# Altium schematic sheet DAC.SchDoc
size 406 x 304 mm; SheetNumber: 3; SheetTotal: 3
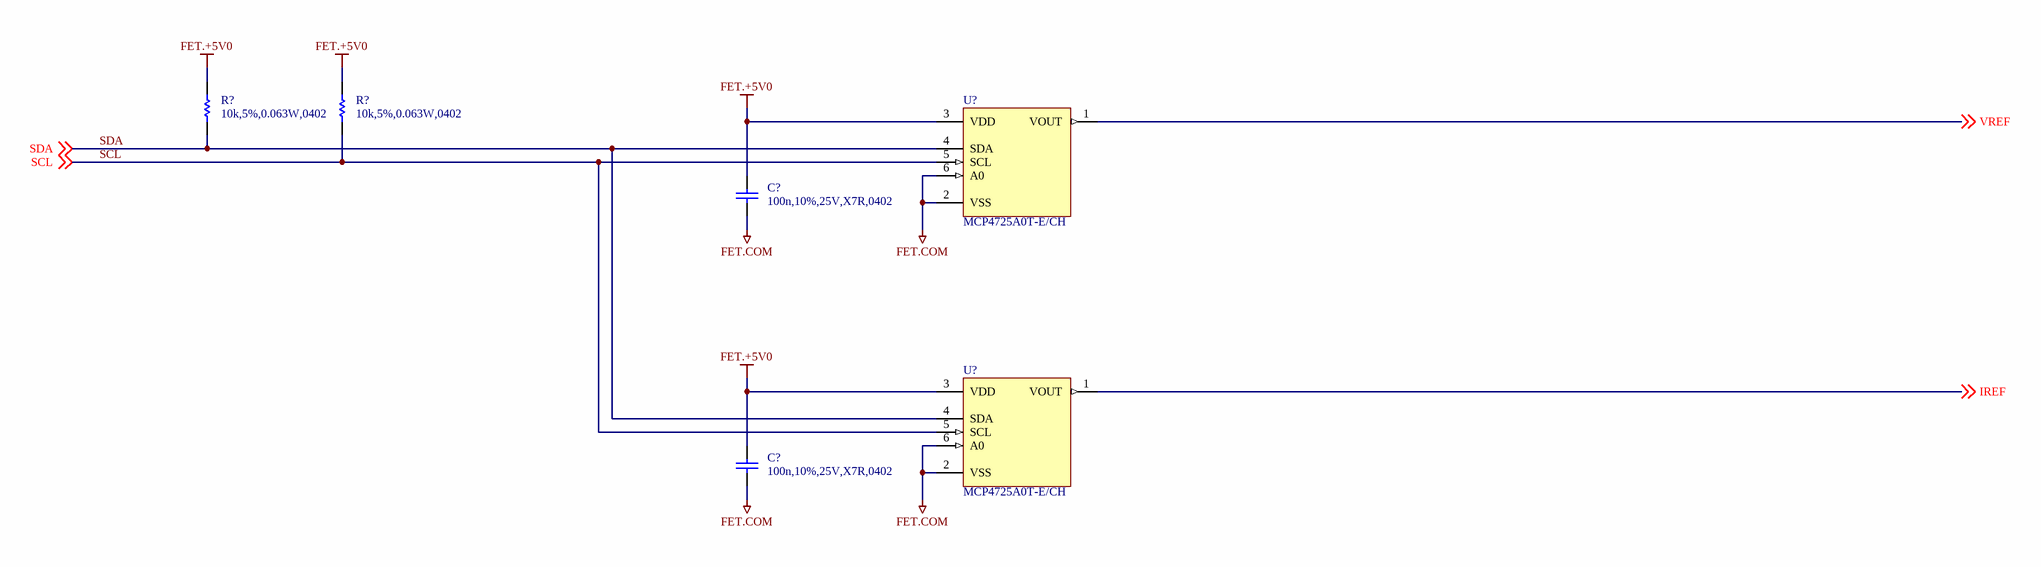
[diagram p0: DAC.SchDoc]

## Parts
(Parts that share a designator on the sheet are numbered #1, #2 ... from top to bottom, then left to right.)
C?#1  100n,10%,25V,X7R,0402  [CAPC1005X06N]
C?#2  100n,10%,25V,X7R,0402  [CAPC1005X06N]
R?#1  10k,5%,0.063W,0402  [RESC1005X04N]
R?#2  10k,5%,0.063W,0402  [RESC1005X04N]
U?#1  MCP4725A0T-E/CH  [SOTFL95P260X145-6]
U?#2  MCP4725A0T-E/CH  [SOTFL95P260X145-6]

## Nets
FET.+5V0: C?#1.2 C?#2.2 R?#1.2 R?#2.2 U?#1.3(VDD) U?#2.3(VDD)
FET.COM: C?#1.1 C?#2.1 U?#1.2(VSS) U?#1.6(A0) U?#2.2(VSS) U?#2.6(A0)
IREF: U?#2.1(VOUT) ; off-sheet IREF
SCL: R?#2.1 U?#1.5(SCL) U?#2.5(SCL) ; off-sheet SCL
SDA: R?#1.1 U?#1.4(SDA) U?#2.4(SDA) ; off-sheet SDA
VREF: U?#1.1(VOUT) ; off-sheet VREF

## Notes on the sheet
- Rev
- Sheet Name:
- Date:
- Sheet
- Designer:
- of

## Library data of the parts
C?#1 C?#2 = CAP,Cer,100nF,10%,25V,X7R,0402: 0.1ï¿½F ï¿½10% 25V Ceramic Capacitor X7R 0402 (1005 Metric); Manufacturer 1: Murata Electronics; Manufacturer 1 Part Number: GRM155R71E104KE14J; Vendor 1 Part Number: 490-14603-1-ND; Vendor 1: DigiKey; Value: 100nF; Part Name: CAP,Cer,100nF,10%,25V,X7R,0402; CreatedBy: Judd Foster; HelpURL: https://search.murata.co.jp/Ceramy/image/img/A01X/G101/ENG/GRM155R71E104KE14-01.pdf
R?#1 R?#2 = RES,10k,5%,0.063W,0402: 10 kOhms ï¿½5% 0.063W, 1/16W Chip Resistor 0402 (1005 Metric) Automotive AEC-Q200 Thick Film; Manufacturer 1: Stackpole Electronics Inc; Manufacturer 1 Part Number: RMCF0402JT10K0; Vendor 1 Part Number: RMCF0402JT10K0CT-ND; Vendor 1: DIgikey; Part Name: RES,10k,5%,0.063W,0402; CreatedBy: Judd Foster; HelpURL: https://www.seielect.com/catalog/sei-rmcf_rmcp.pdf; Value: 10k
U?#1 U?#2 = MCP4725A0T-E/CH: 6us 12 I2C 2.7V~5.5V SOT-23-6 Digital To Analog Converters (DACs) ROHS; Manufacturer 1: Microchip; Vendor 1 Part Number: C144198; Vendor 1: LCSC; Part Name: MCP4725A0T-E/CH; CreatedBy: Judd Foster; HelpURL: https://datasheet.lcsc.com/lcsc/1811151442_Microchip-Tech-MCP4725A0T-E-CH_C144198.pdf; Manufacturer 1 Part Number: MCP4725A0T-E/CH